# EAGLE schematic MouseGoggles Hat-1-5 (EAGLE 9.6.2)
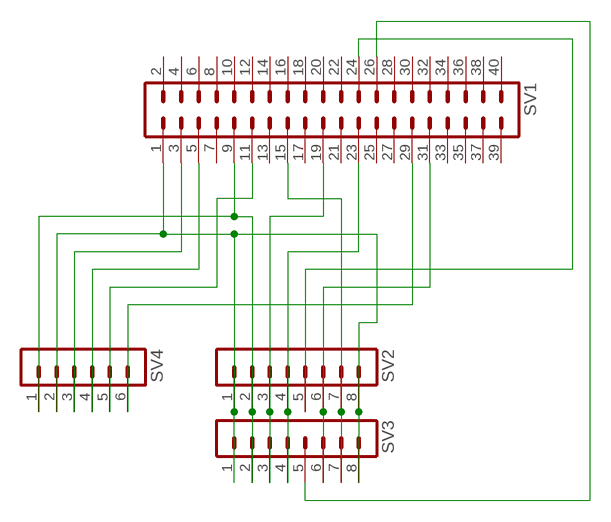
[diagram p0: schematic, sheet 1]

## Parts
SV1  MA20-2  [MA20-2]
SV2  MA08-1  [MA08-1]
SV3  MA08-1  [MA08-1]
SV4  MA06-1  [MA06-1]

## Nets
N$1: SV1.1 SV2.1 SV2.8 SV3.1 SV3.8 SV4.2
N$2: SV1.9 SV2.2 SV3.2 SV4.1
N$3: SV1.19 SV2.3 SV3.3
N$4: SV1.23 SV2.4 SV3.4
N$5: SV1.24 SV2.5
N$6: SV1.26 SV3.5
N$7: SV1.31 SV2.6 SV3.6
N$8: SV1.15 SV2.7 SV3.7
N$9: SV1.3 SV4.3
N$10: SV1.5 SV4.4
N$11: SV1.11 SV4.5
N$12: SV1.29 SV4.6
Unconnected: SV1.2 SV1.4 SV1.6 SV1.7 SV1.8 SV1.10 SV1.12 SV1.13 SV1.14 SV1.16 SV1.17 SV1.18 SV1.20 SV1.21 SV1.22 SV1.25 SV1.27 SV1.28 SV1.30 SV1.32 SV1.33 SV1.34 SV1.35 SV1.36 SV1.37 SV1.38 SV1.39 SV1.40

## Library data of the parts
SV1 = con-lstb:MA20-2: PIN HEADER; OC_FARNELL: unknown; OC_NEWARK: unknown
SV2 SV3 = con-lstb:MA08-1: PIN HEADER; OC_FARNELL: unknown; OC_NEWARK: unknown
SV4 = con-lstb:MA06-1: PIN HEADER; OC_FARNELL: unknown; OC_NEWARK: unknown